# EAGLE schematic Schematic (EAGLE 9.1.3)
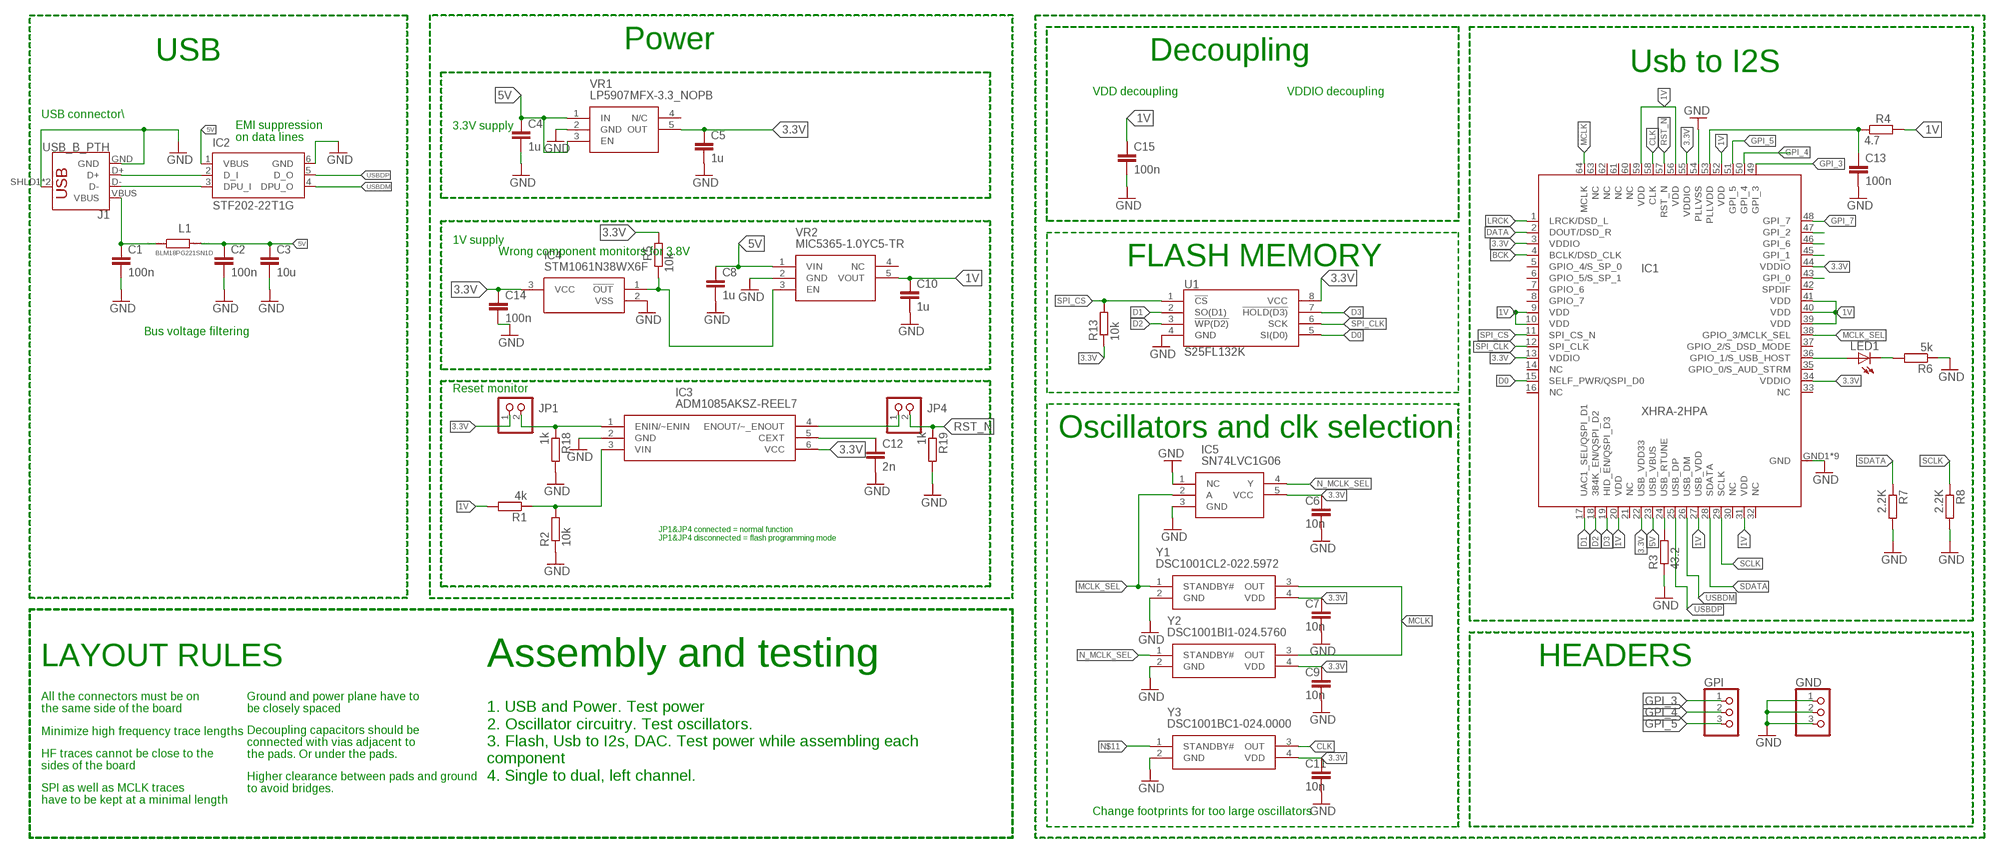
[diagram p0: schematic, sheet 1, part 1 of 2]
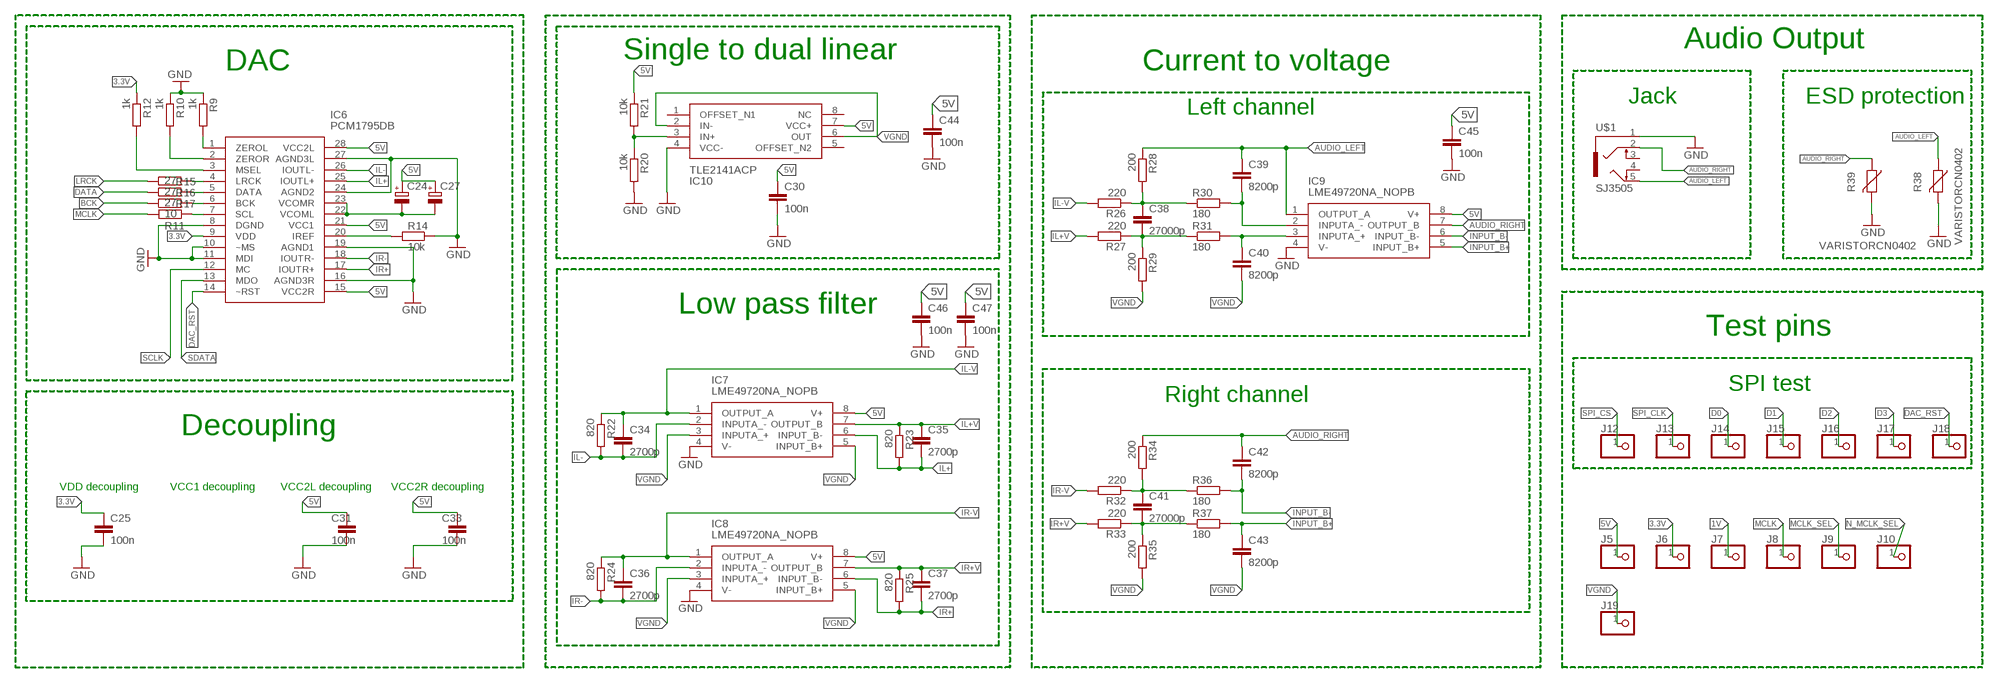
[diagram p1: schematic, sheet 1, part 2 of 2]

## Parts
C1  100n  C-EUC0603K  [C0603K]
C2  100n  C-EUC0603K  [C0603K]
C3  10u  C-EUC0603K  [C0603K]
C4  1u  C-EUC0603K  [C0603K]
C5  1u  C-EUC0603K  [C0603K]
C6  10n  C-EUC0603K  [C0603K]
C7  10n  C-EUC0603K  [C0603K]
C8  1u  C-EUC0603K  [C0603K]
C9  10n  C-EUC0603K  [C0603K]
C10  1u  C-EUC0603K  [C0603K]
C11  10n  C-EUC0603K  [C0603K]
C12  2n  C-EUC0603K  [C0603K]
C13  100n  C-EUC0603K  [C0603K]
C14  100n  C-EUC0603K  [C0603K]
C15  100n  C-EUC0603K  [C0603K]
C24  CPOL-EUSANYO_SMD_B6  [SANYO-OSCON_SMD_B6]
C25  100n  C-EUC0603K  [C0603K]
C27  CPOL-EUSANYO_SMD_B6  [SANYO-OSCON_SMD_B6]
C30  100n  C-EUC0603K  [C0603K]
C31  100n  C-EUC0603K  [C0603K]
C33  100n  C-EUC0603K  [C0603K]
C34  2700p  C-EUC0805  [C0805]
C35  2700p  C-EUC0805  [C0805]
C36  2700p  C-EUC0805  [C0805]
C37  2700p  C-EUC0805  [C0805]
C38  27000p  C-EUC1210  [C1210]
C39  8200p  C-EUC0805  [C0805]
C40  8200p  C-EUC0805  [C0805]
C41  27000p  C-EUC1210  [C1210]
C42  8200p  C-EUC0805  [C0805]
C43  8200p  C-EUC0805  [C0805]
C44  100n  C-EUC0603K  [C0603K]
C45  100n  C-EUC0603K  [C0603K]
C46  100n  C-EUC0603K  [C0603K]
C47  100n  C-EUC0603K  [C0603K]
GND  PINHD-1X3  [1X03]
GPI  PINHD-1X3  [1X03]
IC1  XHRA-2HPA  [TQFP64]
IC2  STF202-22T1G  [SOT23-6]
IC3  ADM1085AKSZ-REEL7  [SOT65P210X110-6N]
IC4  STM1061N38WX6F  [SOT103P237X112-3N]
IC5  SN74LVC1G06  SN74LVC1G17QDBVRQ1  [SOT95P280X145-5N]
IC6  PCM1795DB  [SOP65P780X200-28N]
IC7  LME49720NA_NOPB  [DIP794W53P254L959H508Q8N]
IC8  LME49720NA_NOPB  [DIP794W53P254L959H508Q8N]
IC9  LME49720NA_NOPB  [DIP794W53P254L959H508Q8N]
IC10  TLE2141ACP  [DIP794W53P254L959H508Q8N]
J1  USB_B_PTH  [USB-B-PTH]
J5  PINHD-1X1  [1X01]
J6  PINHD-1X1  [1X01]
J7  PINHD-1X1  [1X01]
J8  PINHD-1X1  [1X01]
J9  PINHD-1X1  [1X01]
J10  PINHD-1X1  [1X01]
J12  PINHD-1X1  [1X01]
J13  PINHD-1X1  [1X01]
J14  PINHD-1X1  [1X01]
J15  PINHD-1X1  [1X01]
J16  PINHD-1X1  [1X01]
J17  PINHD-1X1  [1X01]
J18  PINHD-1X1  [1X01]
J19  PINHD-1X1  [1X01]
JP1  PINHD-1X2  [1X02]
JP4  PINHD-1X2  [1X02]
L1  BLM18PG221SN1D  RR0603  [R0603]
LED1  LEDSML0603  [SML0603]
R1  4k  R-EU_R0603  [R0603]
R2  10k  R-EU_R0603  [R0603]
R3  43.2  R-EU_R0603  [R0603]
R4  4.7  R-EU_R0603  [R0603]
R5  10k  R-EU_R0603  [R0603]
R6  5k  R-EU_R0603  [R0603]
R7  2.2K  R-EU_R0603  [R0603]
R8  2.2K  R-EU_R0603  [R0603]
R9  1k  R-EU_R0603  [R0603]
R10  1k  R-EU_R0603  [R0603]
R11  10  R-EU_R0603  [R0603]
R12  1k  R-EU_R0603  [R0603]
R13  10k  R-EU_R0603  [R0603]
R14  10k  R-EU_R0603  [R0603]
R15  27  R-EU_R0603  [R0603]
R16  27  R-EU_R0603  [R0603]
R17  27  R-EU_R0603  [R0603]
R18  1k  R-EU_R0603  [R0603]
R19  1k  R-EU_R0603  [R0603]
R20  10k  R-EU_R0603  [R0603]
R21  10k  R-EU_R0603  [R0603]
R22  820  R-EU_R0603  [R0603]
R23  820  R-EU_R0603  [R0603]
R24  820  R-EU_R0603  [R0603]
R25  820  R-EU_R0603  [R0603]
R26  220  R-EU_R0603  [R0603]
R27  220  R-EU_R0603  [R0603]
R28  200  R-EU_R0603  [R0603]
R29  200  R-EU_R0603  [R0603]
R30  180  R-EU_R0603  [R0603]
R31  180  R-EU_R0603  [R0603]
R32  220  R-EU_R0603  [R0603]
R33  220  R-EU_R0603  [R0603]
R34  200  R-EU_R0603  [R0603]
R35  200  R-EU_R0603  [R0603]
R36  180  R-EU_R0603  [R0603]
R37  180  R-EU_R0603  [R0603]
R38  VARISTORCN0402  [CT/CN0402]
R39  VARISTORCN0402  [CT/CN0402]
U1  S25FL132K  AT25SF041  [SO08]
U$1  SJ3505  [SJ3505]
VR1  LP5907MFX-3.3_NOPB  [SOT95P280X145-5N]
VR2  MIC5365-1.0YC5-TR  MIC5365-1.8YC5-TR  [SOT65P210X110-5N]
Y1  DSC1001CL2-022.5972  DSC1001DL2-049.5000T  [DSC1001DL50250000T]
Y2  DSC1001BI1-024.5760  DSC1001DL2-049.5000T  [DSC1001DL50250000T]
Y3  DSC1001BC1-024.0000  DSC1001DL2-049.5000T  [DSC1001DL50250000T]

## Nets
1V: C10.1 C15.1 IC1.9(VDD) IC1.10(VDD) IC1.20(VDD) IC1.27(USB_VDD) IC1.31(VDD) IC1.39(VDD) IC1.40(VDD) IC1.41(VDD) IC1.52(VDD) IC1.56(VDD) IC1.59(VDD) J7.1 R1.2 R4.2 VR2.5(VOUT)
3.3V: C5.1 C6.1 C7.1 C9.1 C11.1 C14.1 C25.1 IC1.3(VDDIO) IC1.13(VDDIO) IC1.22(USB_VDD33) IC1.34(VDDIO) IC1.44(VDDIO) IC1.55(VDDIO) IC3.6(VCC) IC4.3(VCC) IC5.5(VCC) IC6.9(VDD) J6.1 JP1.1 R5.2 R12.1 R13.1 U1.8(VCC) VR1.5(OUT) Y1.4(VDD) Y2.4(VDD) Y3.4(VDD)
5V: C2.1 C3.1 C4.1 C8.1 C24.+ C27.+ C30.1 C31.1 C33.1 C44.1 C45.1 C46.1 C47.1 IC1.23(USB_VBUS) IC2.1(VBUS) IC6.15(VCC2R) IC6.21(VCC1) IC6.28(VCC2L) IC7.8(V+) IC8.8(V+) IC9.8(V+) IC10.7(VCC+) J5.1 L1.2 R21.1 VR1.1(IN) VR1.3(EN) VR2.1(VIN)
AUDIO_LEFT: C39.1 IC9.1(OUTPUT_A) R28.1 R38.1 U$1.5
AUDIO_RIGHT: C42.1 IC9.7(OUTPUT_B) R34.1 R39.1 U$1.2
BCK: IC1.4(BCLK/DSD_CLK) R17.1
CLK: IC1.58(CLK) Y3.3(OUT)
D0: IC1.15(SELF_PWR/QSPI_D0) J14.1 U1.5(SI(D0))
D1: IC1.17(UAC1_SEL/QSPI_D1) J15.1 U1.2(SO(D1))
D2: IC1.18(384K_EN/QSPI_D2) J16.1 U1.3(!WP(D2))
D3: IC1.19(HID_EN/QSPI_D3) J17.1 U1.7(!HOLD(D3))
DAC_RST: IC6.14(~RST) J18.1
DATA: IC1.2(DOUT/DSD_R) R16.1
DM_I: IC2.3(DPU_I) J1.D-
DP_I: IC2.2(D_I) J1.D+
GND: C1.2 C2.2 C3.2 C4.2 C5.2 C6.2 C7.2 C8.2 C9.2 C10.2 C11.2 C12.2 C13.2 C14.2 C15.2 C25.2 C30.2 C31.2 C33.2 C44.2 C45.2 C46.2 C47.2 GND.1 GND.2 GND.3 IC1.54(PLLVSS) IC1.GND1(GND) IC1.GND2(GND) IC1.GND3(GND) IC1.GND4(GND) IC1.GND5(GND) IC1.GND6(GND) IC1.GND7(GND) IC1.GND8(GND) IC1.GND9(GND) IC2.6(GND) IC3.2(GND) IC4.2(VSS) IC5.1(NC) IC5.3(GND) IC6.8(DGND) IC6.10(~MS) IC6.11(MDI) IC6.16(AGND3R) IC6.19(AGND1) IC6.24(AGND2) IC6.27(AGND3L) IC7.4(V-) IC8.4(V-) IC9.4(V-) IC10.4(VCC-) J1.GND J1.SHLD1(SHIELD) J1.SHLD2(SHIELD) R2.1 R3.1 R6.1 R7.2 R8.2 R9.1 R10.1 R14.1 R18.2 R19.2 R20.2 R38.2 R39.2 U1.4(GND) U$1.1 VR1.2(GND) VR2.2(GND) Y1.2(GND) Y2.2(GND) Y3.2(GND)
GPI_0: IC1.43(GPI_0)
GPI_1: IC1.45(GPI_1)
GPI_2: IC1.47(GPI_2)
GPI_3: GPI.1 IC1.49(GPI_3)
GPI_4: GPI.2 IC1.50(GPI_4)
GPI_5: GPI.3 IC1.51(GPI_5)
GPI_6: IC1.46(GPI_6)
GPI_7: IC1.48(GPI_7)
IL+: C35.2 IC6.25(IOUTL+) IC7.6(INPUT_B-) R23.2
IL+V: C35.1 IC7.7(OUTPUT_B) R23.1 R27.2
IL-: C34.2 IC6.26(IOUTL-) IC7.2(INPUTA_-) R22.2
IL-V: C34.1 IC7.1(OUTPUT_A) R22.1 R26.2
INPUT_B+: C43.1 IC9.5(INPUT_B+) R37.2
INPUT_B-: C42.2 IC9.6(INPUT_B-) R36.2
IR+: C37.2 IC6.17(IOUTR+) IC8.6(INPUT_B-) R25.2
IR+V: C37.1 IC8.7(OUTPUT_B) R25.1 R33.2
IR-: C36.2 IC6.18(IOUTR-) IC8.2(INPUTA_-) R24.2
IR-V: C36.1 IC8.1(OUTPUT_A) R24.1 R32.2
LRCK: IC1.1(LRCK/DSD_L) R15.1
MCLK: IC1.64(MCLK) J8.1 R11.2 Y1.3(OUT) Y2.3(OUT)
MCLK_SEL: IC1.38(GPIO_3/MCLK_SEL) IC5.2(A) J9.1 Y1.1(STANDBY#)
N$2: C1.1 J1.VBUS L1.1
N$4: C12.1 IC3.5(CEXT)
N$5: IC3.3(VIN) R1.1 R2.2
N$6: IC1.24(USB_RTUNE) R3.2
N$7: C13.1 IC1.53(PLLVDD) R4.1
N$8: IC4.1(!OUT) R5.1 VR2.3(EN)
N$11: Y3.1(STANDBY#)
N$13: IC1.36(GPIO_1/S_USB_HOST) LED1.A
N$14: LED1.C R6.2
N$16: IC6.1(ZEROL) R9.2
N$18: IC6.7(SCL) R11.1
N$19: IC6.2(ZEROR) R10.2
N$20: IC6.3(MSEL) R12.2
N$21: IC6.20(IREF) R14.2
N$22: IC6.4(LRCK) R15.2
N$23: IC6.6(BCK) R17.2
N$24: IC6.5(DATA) R16.2
N$25: IC3.1(ENIN/~ENIN) JP1.2 R18.1
N$29: IC3.4(ENOUT/~_ENOUT) JP4.1
N$30: C24.- C27.- IC6.22(VCOML) IC6.23(VCOMR)
N$35: IC10.3(IN+) R20.1 R21.2
N$39: C38.1 R26.1 R28.2 R30.1
N$40: C38.2 R27.1 R29.1 R31.1
N$41: C40.1 IC9.3(INPUTA_+) R31.2
N$42: C39.2 IC9.2(INPUTA_-) R30.2
N$45: C41.1 R32.1 R34.2 R36.1
N$46: C41.2 R33.1 R35.1 R37.1
N_MCLK_SEL: IC5.4(Y) J10.1 Y2.1(STANDBY#)
RST_N: IC1.57(RST_N) JP4.2 R19.1
SCLK: IC1.29(SCLK) IC6.12(MC) R8.1
SDATA: IC1.28(SDATA) IC6.13(MDO) R7.1
SPI_CLK: IC1.12(SPI_CLK) J13.1 U1.6(SCK)
SPI_CS: IC1.11(SPI_CS_N) J12.1 R13.2 U1.1(!CS)
USBDM: IC1.26(USB_DM) IC2.4(DPU_O)
USBDP: IC1.25(USB_DP) IC2.5(D_O)
VGND: C40.2 C43.2 IC7.3(INPUTA_+) IC7.5(INPUT_B+) IC8.3(INPUTA_+) IC8.5(INPUT_B+) IC10.2(IN-) IC10.6(OUT) J19.1 R29.2 R35.2
Unconnected: IC1.5(GPIO_4/S_SP_0) IC1.6(GPIO_5/S_SP_1) IC1.7(GPIO_6) IC1.8(GPIO_7) IC1.14(NC) IC1.16(NC) IC1.21(NC) IC1.30(NC) IC1.32(NC) IC1.33(NC) IC1.35(GPIO_0/S_AUD_STRM) IC1.37(GPIO_2/S_DSD_MODE) IC1.42(SPDIF) IC1.60(NC) IC1.61(NC) IC1.62(NC) IC1.63(NC) IC10.1(OFFSET_N1) IC10.5(OFFSET_N2) IC10.8(NC) U$1.3 U$1.4 VR1.4(N/C) VR2.4(NC)

## Notes on the sheet
- Power | Audio Output
- USB | Decoupling | Single to dual linear
- Usb to I2S | DAC | Current to voltage
- VDD decoupling | VDDIO decoupling
- Jack | ESD protection
- USB connector\ | Left channel
- 3.3V supply
- EMI suppression
  on data lines
- 1V supply
- Wrong component monitors for 3.8V
- FLASH MEMORY
- Low pass filter
- Bus voltage filtering
- Test pins
- Reset monitor
- SPI test
- Right channel
- Oscillators and clk selection
- Decoupling
- VDD decoupling | VCC1 decoupling | VCC2L decoupling | VCC2R decoupling
- JP1&JP4 connected = normal function
  JP1&JP4 disconnected = flash programming mode
- LAYOUT RULES | Assembly and testing | HEADERS
- All the connectors must be on 
  the same side of the board
- Ground and power plane have to
  be closely spaced
- Minimize high frequency trace lengths
- Decoupling capacitors should be
  connected with vias adjacent to 
  the pads. Or under the pads.
- HF traces cannot be close to the
  sides of the board
- 1. USB and Power. Test power
  2. Oscillator circuitry. Test oscillators.
  3. Flash, Usb to I2s, DAC. Test power while assembling each
  component
  4. Single to dual, left channel.
- Higher clearance between pads and ground
  to avoid bridges.
- SPI as well as MCLK traces
  have to be kept at a minimal length
- Change footprints for too large oscillators

## Library data of the parts
C1 C2 C13-C15 C25 C30 C31 C33 C44-C47 = resistor:C-EU: CAPACITOR, European symbol; MPN: A104M15X7RF5TAA; OC_NEWARK: 74AC7050
C3-C12 = resistor:C-EU: CAPACITOR, European symbol; OC_NEWARK: unknown
C24 C27 = rcl:CPOL-EU: POLARIZED CAPACITOR, European symbol; OC_NEWARK: unknown; SPICEPREFIX: C
C34-C43 = rcl:C-EU: CAPACITOR, European symbol; SPICEPREFIX: C
GND GPI = pinhead:PINHD-1X3: PIN HEADER
IC1 = pavouk:XHRA-2HPA: XHRA-2HPA xCORE-AUDIO Processor; OC_NEWARK: unknown
IC2 = stf202_10:STF202-22T1G: USB Filter with ESD Protection Source: http://www.onsemi.com/pub_link/Collateral/STF202-22T1-D.PDF; MF: ON SEMICONDUCTOR; MPN: STF202-22T1G; OC_FARNELL: 1651958; OC_NEWARK: 45J2271
IC3 = ADM1085AKSZ-REEL7:ADM1085AKSZ-REEL7: Analog Devices ADM1085AKSZ-REEL7, Voltage Supervisor, 0.6 22 V, 6-Pin SC-70 Source: Datasheet; ARROW_PART_NUMBER: ADM1085AKSZ-REEL7; ARROW_PRICE/STOCK: https://www.arrow.com/en/products/adm1085aksz-reel7/analog-devices; DESCRIPTION: Analog Devices ADM1085AKSZ-REEL7, Voltage Supervisor, 0.6 22 V, 6-Pin SC-70; HEIGHT: mm; MANUFACTURER_NAME: Analog Devices; MANUFACTURER_PART_NUMBER: ADM1085AKSZ-REEL7; OC_NEWARK: unknown; RS_PART_NUMBER: 7427705P; RS_PRICE/STOCK: http://uk.rs-online.com/web/p/products/7427705P
IC4 = STM1061N38WX6F:STM1061N38WX6F: STM1061N38WX6F, Voltage Detector 3.724V Low Power Voltage Detector 3-Pin SOT-23 Source: Datasheet <http://docs-europe.electrocomponents.com/webdocs/0db0/0900766b80db0f10.pdf>; ALLIED_NUMBER: 70390901; ALLIED_PRICE/STOCK: http://www.alliedelec.com/stmicroelectronics-stm1061n38wx6f/70390901/; ARROW_PART_NUMBER: STM1061N38WX6F; ARROW_PRICE/STOCK: https://www.arrow.com/en/products/stm1061n38wx6f/stmicroelectronics; DESCRIPTION: STM1061N38WX6F, Voltage Detector 3.724V Low Power Voltage Detector 3-Pin SOT-23; HEIGHT: 1.12mm; MANUFACTURER_NAME: STMicroelectronics; MANUFACTURER_PART_NUMBER: STM1061N38WX6F; OC_NEWARK: unknown; RS_PART_NUMBER: 6864800; RS_PRICE/STOCK: http://uk.rs-online.com/web/p/voltage-supervisors/6864800/?source=DS
IC5 = SN74LVC1G17QDBVRQ1:SN74LVC1G17QDBVRQ1: Automotive Catalog Single Schmitt-Trigger Buffer Source: Datasheet <http://www.ti.com/lit/gpn/sn74lvc1g17-q1>; ARROW_PART_NUMBER: SN74LVC1G17QDBVRQ1; ARROW_PRICE/STOCK: https://www.arrow.com/en/products/sn74lvc1g17qdbvrq1/texas-instruments; DESCRIPTION: Automotive Catalog Single Schmitt-Trigger Buffer; HEIGHT: 1.45mm; MANUFACTURER_NAME: Texas Instruments; MANUFACTURER_PART_NUMBER: SN74LVC1G17QDBVRQ1; OC_NEWARK: unknown
IC6 = PCM1795DB:PCM1795DB: 32-Bit, 192-kHz Sampling, Advanced Segment Stereo Audio Digital-to-Analog Converter Source: Datasheet <http://componentsearchengine.com/Datasheets/3/PCM1795DB.pdf>; ARROW_PART_NUMBER: PCM1795DB; ARROW_PRICE-STOCK: https://www.arrow.com/en/products/pcm1795db/texas-instruments; DESCRIPTION: 32-Bit, 192-kHz Sampling, Advanced Segment Stereo Audio Digital-to-Analog Converter; HEIGHT: mm; MANUFACTURER_NAME: Texas Instruments; MANUFACTURER_PART_NUMBER: PCM1795DB; OC_NEWARK: unknown; RS_PART_NUMBER: 8143710P; RS_PRICE-STOCK: http://uk.rs-online.com/web/p/products/8143710P
IC7-IC9 = LME49720NA_NOPB:LME49720NA_NOPB: OP Amp Dual GP 17V PDIP8 Texas Instruments LME49720NA/NOPB, Dual Audio Op Amp, 55MHz Rail-Rail, 8-Pin PDIP Source: Datasheet <http://www.ti.com/lit/ds/symlink/lme49720.pdf>; ARROW_PART_NUMBER: LME49720NA/NOPB; ARROW_PRICE-STOCK: https://www.arrow.com/en/products/lme49720nanopb/texas-instruments; DESCRIPTION: OP Amp Dual GP 17V PDIP8 Texas Instruments LME49720NA/NOPB, Dual Audio Op Amp, 55MHz Rail-Rail, 8-Pin PDIP; HEIGHT: 5.08mm; MANUFACTURER_NAME: Texas Instruments; MANUFACTURER_PART_NUMBER: LME49720NA/NOPB; OC_NEWARK: unknown; RS_PART_NUMBER: 7616217P; RS_PRICE-STOCK: http://uk.rs-online.com/web/p/products/7616217P
IC10 = TLE2141ACP:TLE2141ACP: Excalibur Low-Noise High-Speed Precision Operational Amplifier Source: Datasheet <http://www.ti.com/lit/ds/symlink/tle2141a.pdf>; ARROW_PART_NUMBER: TLE2141ACP; ARROW_PRICE-STOCK: https://www.arrow.com/en/products/tle2141acp/texas-instruments; DESCRIPTION: Excalibur Low-Noise High-Speed Precision Operational Amplifier; HEIGHT: 5.08mm; MANUFACTURER_NAME: Texas Instruments; MANUFACTURER_PART_NUMBER: TLE2141ACP; OC_NEWARK: unknown; RS_PART_NUMBER: 6612003P; RS_PRICE-STOCK: http://uk.rs-online.com/web/p/products/6612003P
J1 = SparkFun-Connectors:USB_B: USB Type B Connector SparkFun Products: SparkFun Stepoko <https://www.sparkfun.com/products/13899> PTH; OC_NEWARK: unknown; PROD_ID: CONN-08278; SF_ID: PRT-00139
J5-J10 J12-J19 = pinhead:PINHD-1X1: PIN HEADER
JP1 JP4 = pinhead:PINHD-1X2: PIN HEADER; OC_NEWARK: unknown
L1 = eagle-ltspice:R: RESISTOR, European symbol; OC_NEWARK: unknown; SPICEMODEL: NONE; SPICEPREFIX: R
LED1 = led:LED: LED OSRAM: - CHIPLED LG R971, LG N971, LY N971, LG Q971, LY Q971, LO R971, LY R971 LH N974, LH R974 LS Q976, LO Q976, LY Q976 LO Q996 - Hyper CHIPLED LW Q18S LB Q993, LB Q99A, LB R99A - SideLED LS A670, LO A670, LY A670, LG A670, LP A670 LB A673, LV A673, LT A673, LW A673 LH A674 LY A675 LS A676, LA A676, LO A676, LY A676, LW A676 LS A679, LY A679, LG A679 - Hyper Micro SIDELED® LS Y876, LA Y876, LO Y876, LY Y876 LT Y87S - SmartLED LW L88C, LW L88S LB L89C, LB L89S, LG L890 LS L89K, LO L89K, LY L89K LS L896, LA L896, LO L896, LY L896 - TOPLED LS T670, LO T670, LY T670, LG T670, LP T670 LSG T670, LSP T670, LSY T670, LOP T670, LYG T670 LG T671, LOG T671, LSG T671 LB T673, LV T673, LT T673, LW T673 LH T674 LS T676, LA T676, LO T676, LY T676, LB T676, LH T676, LSB T676, LW T676 LB T67C, LV T67C, LT T67C, LS T67K, LO T67K, LY T67K, LW E67C LS E67B, LA E67B, LO E67B, LY E67B, LB E67C, LV E67C, LT E67C LW T67C LS T679, LY T679, LG T679 LS T770, LO T770, LY T770, LG T770, LP T770 LB T773, LV T773, LT T773, LW T773 LH T774 LS E675, LA E675, LY E675, LS T675 LS T776, LA T776, LO T776, LY T776, LB T776 LHGB T686 LT T68C, LB T68C - Hyper Mini TOPLED® LB M676 - Mini TOPLED Santana® LG M470 LS M47K, LO M47K, LY M47K Source: http://www.osram.convergy.de LUXEON: - LUMILED® LXK2-PW12-R00, LXK2-PW12-S00, LXK2-PW14-U00, LXK2-PW14-V00 LXK2-PM12-R00, LXK2-PM12-S00, LXK2-PM14-U00 LXK2-PE12-Q00, LXK2-PE12-R00, LXK2-PE12-S00, LXK2-PE14-T00, LXK2-PE14-U00 LXK2-PB12-K00, LXK2-PB12-L00, LXK2-PB12-M00, LXK2-PB14-N00, LXK2-PB14-P00, LXK2-PB14-Q00 LXK2-PR12-L00, LXK2-PR12-M00, LXK2-PR14-Q00, LXK2-PR14-R00 LXK2-PD12-Q00, LXK2-PD12-R00, LXK2-PD12-S00 LXK2-PH12-R00, LXK2-PH12-S00 LXK2-PL12-P00, LXK2-PL12-Q00, LXK2-PL12-R00 Source: www.luxeon.com KINGBRIGHT: KA-3528ASYC Source: www.kingbright.com; OC_NEWARK: unknown
R1-R37 = resistor:R-EU_: RESISTOR, European symbol; OC_NEWARK: unknown
R38 R39 = varistor:VARISTOR: VARISTOR
U1 = SparkFun-IC-Memory:AT25SF041: AT25SF041 4Mb Serial Flash Memory 104MHz, SPI, 8-SOIC Datasheet <http://www.adestotech.com/wp-content/uploads/DS-AT25SF041_044.pdf> SparkFun Products: SparkFun ESP8266 Thing <https://www.sparkfun.com/products/13231> SparkFun ESP8266 Thing - Dev Board <https://www.sparkfun.com/products/13711>; OC_NEWARK: unknown; PROD_ID: IC-12455; VALUE: 4MB Flash
U$1 = bardiir:SJ3505
VR1 = LP5907MFX-3.3_NOPB:LP5907MFX-3.3_NOPB: TEXAS INSTRUMENTS - LP5907MFX-3.3/NOPB - LDO, FIXED, 3.3V, 0.25A, SOT-23-5 Source: Datasheet <http://www.farnell.com/datasheets/1950580.pdf>; ARROW_PART_NUMBER: LP5907MFX-3.3/NOPB; ARROW_PRICE/STOCK: https://www.arrow.com/en/products/lp5907mfx-3.3nopb/texas-instruments; DESCRIPTION: TEXAS INSTRUMENTS - LP5907MFX-3.3/NOPB - LDO, FIXED, 3.3V, 0.25A, SOT-23-5; HEIGHT: 1.45mm; MANUFACTURER_NAME: Texas Instruments; MANUFACTURER_PART_NUMBER: LP5907MFX-3.3/NOPB; OC_NEWARK: unknown
VR2 = MIC5365-1.8YC5-TR:MIC5365-1.8YC5-TR: IC REG LINEAR 1.8V 150MA SC70-5 Source: Datasheet <http://ww1.microchip.com/downloads/en/DeviceDoc/mic5365.pdf>; ARROW_PART_NUMBER: MIC5365-1.8YC5-TR; ARROW_PRICE/STOCK: http://uk.rs-online.com/web/p/products/1655152; DESCRIPTION: IC REG LINEAR 1.8V 150MA SC70-5; HEIGHT: 1.1mm; MANUFACTURER_NAME: Microchip; MANUFACTURER_PART_NUMBER: MIC5365-1.8YC5-TR; OC_NEWARK: unknown; RS_PART_NUMBER: 1655152; RS_PRICE/STOCK: http://uk.rs-online.com/web/p/products/1655152
Y1-Y3 = DSC1001DL2-049.5000T:DSC1001DL2-049.5000T: Standard Clock Oscillators Oscillator Low Power -40C-105C 25ppm Source: Datasheet <http://ww1.microchip.com/downloads/en/DeviceDoc/20005529B.pdf>; ARROW_PART_NUMBER: DSC1001DL2-049.5000T; DESCRIPTION: Standard Clock Oscillators Oscillator Low Power -40C-105C 25ppm; HEIGHT: 0mm; MANUFACTURER_NAME: Microchip; MANUFACTURER_PART_NUMBER: DSC1001DL2-049.5000T; OC_NEWARK: unknown